# Altium project Placa de alimentação.PrjPcb
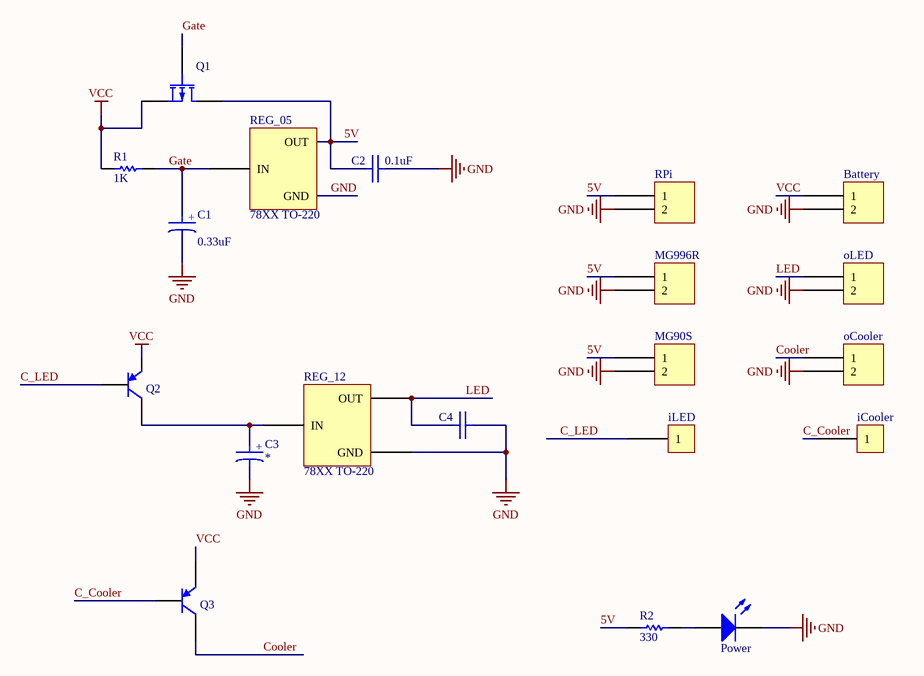
[diagram p0: Placa de alimentação.SchDoc]
1 sheet, 20 parts. Net scope: global (net labels, ports and power ports of the same name join across sheets).
Board file: Placa de alimentação.PcbDoc

## Sheet Placa de alimentação.SchDoc
size A4

### Parts
Battery  *  [XT90]  (value not drawn)
C1  value 0.33uF  [Eletrolytic Capacitor 5x5mm]  (hidden comment: *)
C2  value 0.1uF  [SMD Capacitor]  (hidden comment: *)
C3  *  [Eletrolytic Capacitor 5x5mm]
C4  *  [SMD Capacitor]  (value not drawn)
iCooler  *  [HEADER 1X1 8.5MM]  (value not drawn)
iLED  *  [HEADER 1X1 8.5MM]  (value not drawn)
MG90S  *  [KK2]  (value not drawn)
MG996R  *  [KK2]  (value not drawn)
oCooler  *  [KK2]  (value not drawn)
oLED  *  [KK2]  (value not drawn)
Power  LED 5mm THT  [LED THT]  (value not drawn)
Q1  Mosfet P  [TO-252-3]  (value not drawn)
Q2  *  [TO-220]  (value not drawn)
Q3  *  [TO-220]  (value not drawn)
R1  value 1K  [RESISTOR THT 5mm]  (hidden comment: Resistor THT)
R2  value 330  [RESISTOR THT 5mm]  (hidden comment: Resistor THT)
REG_05  78XX TO-220  [TO-220]
REG_12  78XX TO-220  [TO-220]
RPi  *  [KK2]  (value not drawn)

### Nets
GND: Battery.2 C1.2 C2.1 C3.2 C4.1 MG90S.2 MG996R.2 oCooler.2 oLED.2 Power.2(K) REG_05.2(GND) REG_12.2(GND) RPi.2
VCC: Battery.1 Q1.3(S) Q2.1(E) Q3.1(E) R1.1
5V: C2.2 MG90S.1 MG996R.1 Q1.2(D) R2.1 REG_05.3(OUT) RPi.1
C_Cooler: iCooler.1 Q3.3(B)
C_LED: iLED.1 Q2.3(B)
Cooler: oCooler.1 Q3.2(C)
Gate: C1.1 Q1.1(G) R1.2 REG_05.1(IN)
LED: C4.2 oLED.1 REG_12.3(OUT)
NetC3_1: C3.1 Q2.2(C) REG_12.1(IN)
NetPower_1: Power.1(A) R2.2

### Notes on the sheet
- (in symbol Electrolytic Capacitor 0.33uF) +

### Library data of the parts
Battery = XT90
C1 C3 = Electrolytic Capacitor 0.33uF
C2 C4 = Capacitor SMD 0805
iCooler iLED = Male Pin Head 1x1
MG90S MG996R oCooler oLED RPi = KK2: KK Connector, 2 ways
Q2 Q3 = NPN Transistor TO-220
Power = LED 5mm THT: Color: *
Q1 = Mosfet P: Model: *